# EAGLE schematic ALU (EAGLE 9.6.2)
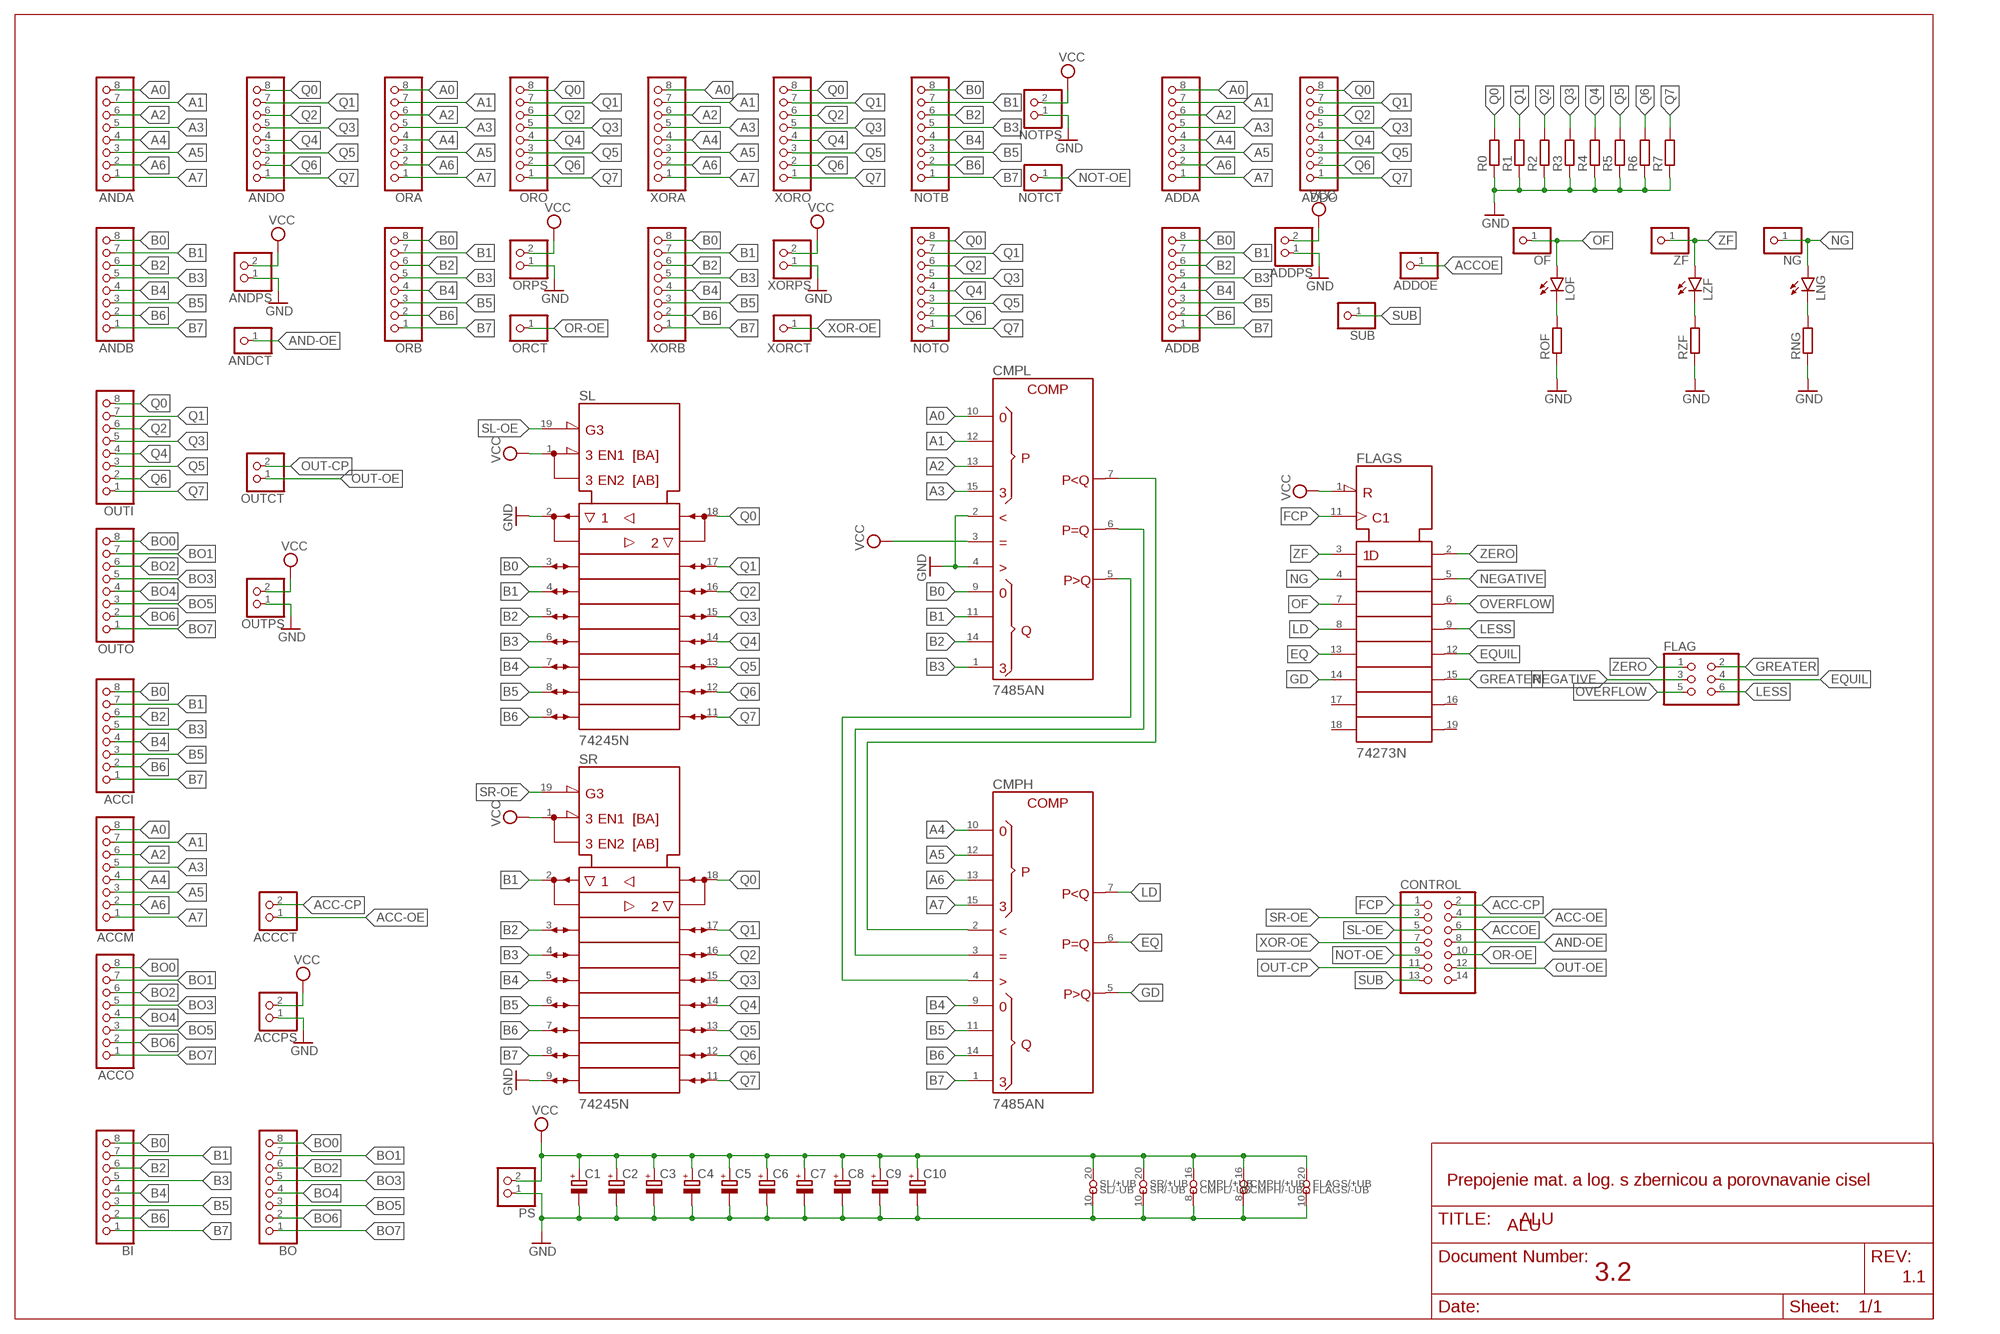
[diagram p0: schematic, sheet 1]

## Parts
ACCCT  PINHD-1X2  [1X02]
ACCI  PINHD-1X8  [1X08]
ACCM  PINHD-1X8  [1X08]
ACCO  PINHD-1X8  [1X08]
ACCPS  PINHD-1X2  [1X02]
ADDA  PINHD-1X8  [1X08]
ADDB  PINHD-1X8  [1X08]
ADDO  PINHD-1X8  [1X08]
ADDOE  PINHD-1X1  [1X01]
ADDPS  PINHD-1X2  [1X02]
ANDA  PINHD-1X8  [1X08]
ANDB  PINHD-1X8  [1X08]
ANDCT  PINHD-1X1  [1X01]
ANDO  PINHD-1X8  [1X08]
ANDPS  PINHD-1X2  [1X02]
BI  PINHD-1X8  [1X08]
BO  PINHD-1X8  [1X08]
C1  CPOL-EUE2.5-6  [E2,5-6]
C2  CPOL-EUE2.5-6  [E2,5-6]
C3  CPOL-EUE2.5-6  [E2,5-6]
C4  CPOL-EUE2.5-6  [E2,5-6]
C5  CPOL-EUE2.5-6  [E2,5-6]
C6  CPOL-EUE2.5-6  [E2,5-6]
C7  CPOL-EUE2.5-6  [E2,5-6]
C8  CPOL-EUE2.5-6  [E2,5-6]
C9  CPOL-EUE2.5-6  [E2,5-6]
C10  CPOL-EUE2.5-6  [E2,5-6]
CMPH  7485AN  [DIL16]
CMPL  7485AN  [DIL16]
CONTROL  PINHD-2X7  [2X07]
FLAG  PINHD-2X3  [2X03]
FLAGS  74273N  [DIL20]
LNG  LED5MM  [LED5MM]
LOF  LED5MM  [LED5MM]
LZF  LED5MM  [LED5MM]
NG  PINHD-1X1  [1X01]
NOTB  PINHD-1X8  [1X08]
NOTCT  PINHD-1X1  [1X01]
NOTO  PINHD-1X8  [1X08]
NOTPS  PINHD-1X2  [1X02]
OF  PINHD-1X1  [1X01]
ORA  PINHD-1X8  [1X08]
ORB  PINHD-1X8  [1X08]
ORCT  PINHD-1X1  [1X01]
ORO  PINHD-1X8  [1X08]
ORPS  PINHD-1X2  [1X02]
OUTCT  PINHD-1X2  [1X02]
OUTI  PINHD-1X8  [1X08]
OUTO  PINHD-1X8  [1X08]
OUTPS  PINHD-1X2  [1X02]
PS  PINHD-1X2  [1X02]
R0  R-EU_0204/7  [0204/7]
R1  R-EU_0204/7  [0204/7]
R2  R-EU_0204/7  [0204/7]
R3  R-EU_0204/7  [0204/7]
R4  R-EU_0204/7  [0204/7]
R5  R-EU_0204/7  [0204/7]
R6  R-EU_0204/7  [0204/7]
R7  R-EU_0204/7  [0204/7]
RNG  R-EU_0204/7  [0204/7]
ROF  R-EU_0204/7  [0204/7]
RZF  R-EU_0204/7  [0204/7]
SL  74245N  [DIL20]
SR  74245N  [DIL20]
SUB  PINHD-1X1  [1X01]
XORA  PINHD-1X8  [1X08]
XORB  PINHD-1X8  [1X08]
XORCT  PINHD-1X1  [1X01]
XORO  PINHD-1X8  [1X08]
XORPS  PINHD-1X2  [1X02]
ZF  PINHD-1X1  [1X01]

## Nets
A0: ACCM.8 ADDA.8 ANDA.8 CMPL.10(P0) ORA.8 XORA.8
A1: ACCM.7 ADDA.7 ANDA.7 CMPL.12(P1) ORA.7 XORA.7
A2: ACCM.6 ADDA.6 ANDA.6 CMPL.13(P2) ORA.6 XORA.6
A3: ACCM.5 ADDA.5 ANDA.5 CMPL.15(P3) ORA.5 XORA.5
A4: ACCM.4 ADDA.4 ANDA.4 CMPH.10(P0) ORA.4 XORA.4
A5: ACCM.3 ADDA.3 ANDA.3 CMPH.12(P1) ORA.3 XORA.3
A6: ACCM.2 ADDA.2 ANDA.2 CMPH.13(P2) ORA.2 XORA.2
A7: ACCM.1 ADDA.1 ANDA.1 CMPH.15(P3) ORA.1 XORA.1
ACC-CP: ACCCT.2 CONTROL.2
ACC-OE: ACCCT.1 CONTROL.4
ACCOE: ADDOE.1 CONTROL.6
AND-OE: ANDCT.1 CONTROL.8
B0: ACCI.8 ADDB.8 ANDB.8 BI.8 CMPL.9(Q0) NOTB.8 ORB.8 SL.3(A2) XORB.8
B1: ACCI.7 ADDB.7 ANDB.7 BI.7 CMPL.11(Q1) NOTB.7 ORB.7 SL.4(A3) SR.2(A1) XORB.7
B2: ACCI.6 ADDB.6 ANDB.6 BI.6 CMPL.14(Q2) NOTB.6 ORB.6 SL.5(A4) SR.3(A2) XORB.6
B3: ACCI.5 ADDB.5 ANDB.5 BI.5 CMPL.1(Q3) NOTB.5 ORB.5 SL.6(A5) SR.4(A3) XORB.5
B4: ACCI.4 ADDB.4 ANDB.4 BI.4 CMPH.9(Q0) NOTB.4 ORB.4 SL.7(A6) SR.5(A4) XORB.4
B5: ACCI.3 ADDB.3 ANDB.3 BI.3 CMPH.11(Q1) NOTB.3 ORB.3 SL.8(A7) SR.6(A5) XORB.3
B6: ACCI.2 ADDB.2 ANDB.2 BI.2 CMPH.14(Q2) NOTB.2 ORB.2 SL.9(A8) SR.7(A6) XORB.2
B7: ACCI.1 ADDB.1 ANDB.1 BI.1 CMPH.1(Q3) NOTB.1 ORB.1 SR.8(A7) XORB.1
BO0: ACCO.8 BO.8 OUTO.8
BO1: ACCO.7 BO.7 OUTO.7
BO2: ACCO.6 BO.6 OUTO.6
BO3: ACCO.5 BO.5 OUTO.5
BO4: ACCO.4 BO.4 OUTO.4
BO5: ACCO.3 BO.3 OUTO.3
BO6: ACCO.2 BO.2 OUTO.2
BO7: ACCO.1 BO.1 OUTO.1
EQ: CMPH.6(PEQQ) FLAGS.13(5D)
EQUIL: FLAG.4 FLAGS.12(5Q)
FCP: CONTROL.1 FLAGS.11(CLK)
GD: CMPH.5(PGTQ) FLAGS.14(6D)
GND: ACCPS.1 ADDPS.1 ANDPS.1 C1.- C2.- C3.- C4.- C5.- C6.- C7.- C8.- C9.- C10.- CMPH.8(-UB) CMPL.2(PLTQ_) CMPL.4(PGTQ_) CMPL.8(-UB) FLAGS.10(-UB) NOTPS.1 ORPS.1 OUTPS.1 PS.1 R0.1 R1.1 R2.1 R3.1 R4.1 R5.1 R6.1 R7.1 RNG.1 ROF.1 RZF.1 SL.2(A1) SL.10(-UB) SR.9(A8) SR.10(-UB) XORPS.1
GREATER: FLAG.2 FLAGS.15(6Q)
LD: CMPH.7(PLTQ) FLAGS.8(4D)
LESS: FLAG.6 FLAGS.9(4Q)
N$1: LOF.K(C) ROF.2
N$2: LZF.K(C) RZF.2
N$3: LNG.K(C) RNG.2
N$26: CMPH.4(PGTQ_) CMPL.5(PGTQ)
N$27: CMPH.3(PEQQ_) CMPL.6(PEQQ)
N$28: CMPH.2(PLTQ_) CMPL.7(PLTQ)
NEGATIVE: FLAG.3 FLAGS.5(2Q)
NG: FLAGS.4(2D) LNG.A NG.1
NOT-OE: CONTROL.9 NOTCT.1
OF: FLAGS.7(3D) LOF.A OF.1
OR-OE: CONTROL.10 ORCT.1
OUT-CP: CONTROL.11 OUTCT.2
OUT-OE: CONTROL.12 OUTCT.1
OVERFLOW: FLAG.5 FLAGS.6(3Q)
Q0: ADDO.8 ANDO.8 NOTO.8 ORO.8 OUTI.8 R0.2 SL.18(B1) SR.18(B1) XORO.8
Q1: ADDO.7 ANDO.7 NOTO.7 ORO.7 OUTI.7 R1.2 SL.17(B2) SR.17(B2) XORO.7
Q2: ADDO.6 ANDO.6 NOTO.6 ORO.6 OUTI.6 R2.2 SL.16(B3) SR.16(B3) XORO.6
Q3: ADDO.5 ANDO.5 NOTO.5 ORO.5 OUTI.5 R3.2 SL.15(B4) SR.15(B4) XORO.5
Q4: ADDO.4 ANDO.4 NOTO.4 ORO.4 OUTI.4 R4.2 SL.14(B5) SR.14(B5) XORO.4
Q5: ADDO.3 ANDO.3 NOTO.3 ORO.3 OUTI.3 R5.2 SL.13(B6) SR.13(B6) XORO.3
Q6: ADDO.2 ANDO.2 NOTO.2 ORO.2 OUTI.2 R6.2 SL.12(B7) SR.12(B7) XORO.2
Q7: ADDO.1 ANDO.1 NOTO.1 ORO.1 OUTI.1 R7.2 SL.11(B8) SR.11(B8) XORO.1
SL-OE: CONTROL.5 SL.19(!G)
SR-OE: CONTROL.3 SR.19(!G)
SUB: CONTROL.13 SUB.1
VCC: ACCPS.2 ADDPS.2 ANDPS.2 C1.+ C2.+ C3.+ C4.+ C5.+ C6.+ C7.+ C8.+ C9.+ C10.+ CMPH.16(+UB) CMPL.3(PEQQ_) CMPL.16(+UB) FLAGS.1(!CLR) FLAGS.20(+UB) NOTPS.2 ORPS.2 OUTPS.2 PS.2 SL.1(DIR) SL.20(+UB) SR.1(DIR) SR.20(+UB) XORPS.2
XOR-OE: CONTROL.7 XORCT.1
ZERO: FLAG.1 FLAGS.2(1Q)
ZF: FLAGS.3(1D) LZF.A ZF.1
Unconnected: CONTROL.14 FLAGS.16(7Q) FLAGS.17(7D) FLAGS.18(8D) FLAGS.19(8Q)

## Notes on the sheet
- Prepojenie mat. a log. s zbernicou a porovnavanie cisel
- ALU
- 3.2 | 1.1

## Library data of the parts
ACCCT ACCPS ADDPS ANDPS NOTPS ORPS OUTCT OUTPS PS XORPS = pinhead:PINHD-1X2: PIN HEADER
ACCI ACCM ACCO ADDA ADDB ADDO ANDA ANDB ANDO BI BO NOTB NOTO ORA ORB ORO OUTI OUTO XORA XORB XORO = pinhead:PINHD-1X8: PIN HEADER
ADDOE ANDCT NG NOTCT OF ORCT SUB XORCT ZF = pinhead:PINHD-1X1: PIN HEADER
C1-C10 = rcl:CPOL-EU: POLARIZED CAPACITOR, European symbol; SPICEPREFIX: C
CMPH CMPL = 74ttl-din:74*85A: 4-bit Magnitude COMPARATOR
CONTROL = pinhead:PINHD-2X7: PIN HEADER
FLAG = pinhead:PINHD-2X3: PIN HEADER
FLAGS = 74ttl-din:74*273: Octal D type FLIP FLOP, clear
LNG LOF LZF = led:LED: LED OSRAM: - CHIPLED LG R971, LG N971, LY N971, LG Q971, LY Q971, LO R971, LY R971 LH N974, LH R974 LS Q976, LO Q976, LY Q976 LO Q996 - Hyper CHIPLED LW Q18S LB Q993, LB Q99A, LB R99A - SideLED LS A670, LO A670, LY A670, LG A670, LP A670 LB A673, LV A673, LT A673, LW A673 LH A674 LY A675 LS A676, LA A676, LO A676, LY A676, LW A676 LS A679, LY A679, LG A679 - Hyper Micro SIDELED® LS Y876, LA Y876, LO Y876, LY Y876 LT Y87S - SmartLED LW L88C, LW L88S LB L89C, LB L89S, LG L890 LS L89K, LO L89K, LY L89K LS L896, LA L896, LO L896, LY L896 - TOPLED LS T670, LO T670, LY T670, LG T670, LP T670 LSG T670, LSP T670, LSY T670, LOP T670, LYG T670 LG T671, LOG T671, LSG T671 LB T673, LV T673, LT T673, LW T673 LH T674 LS T676, LA T676, LO T676, LY T676, LB T676, LH T676, LSB T676, LW T676 LB T67C, LV T67C, LT T67C, LS T67K, LO T67K, LY T67K, LW E67C LS E67B, LA E67B, LO E67B, LY E67B, LB E67C, LV E67C, LT E67C LW T67C LS T679, LY T679, LG T679 LS T770, LO T770, LY T770, LG T770, LP T770 LB T773, LV T773, LT T773, LW T773 LH T774 LS E675, LA E675, LY E675, LS T675 LS T776, LA T776, LO T776, LY T776, LB T776 LHGB T686 LT T68C, LB T68C - Hyper Mini TOPLED® LB M676 - Mini TOPLED Santana® LG M470 LS M47K, LO M47K, LY M47K Source: http://www.osram.convergy.de LUXEON: - LUMILED® LXK2-PW12-R00, LXK2-PW12-S00, LXK2-PW14-U00, LXK2-PW14-V00 LXK2-PM12-R00, LXK2-PM12-S00, LXK2-PM14-U00 LXK2-PE12-Q00, LXK2-PE12-R00, LXK2-PE12-S00, LXK2-PE14-T00, LXK2-PE14-U00 LXK2-PB12-K00, LXK2-PB12-L00, LXK2-PB12-M00, LXK2-PB14-N00, LXK2-PB14-P00, LXK2-PB14-Q00 LXK2-PR12-L00, LXK2-PR12-M00, LXK2-PR14-Q00, LXK2-PR14-R00 LXK2-PD12-Q00, LXK2-PD12-R00, LXK2-PD12-S00 LXK2-PH12-R00, LXK2-PH12-S00 LXK2-PL12-P00, LXK2-PL12-Q00, LXK2-PL12-R00 Source: www.luxeon.com KINGBRIGHT: KA-3528ASYC Source: www.kingbright.com
R0 R1-R7 RNG ROF RZF = rcl:R-EU_: RESISTOR, European symbol; SPICEPREFIX: R
SL SR = 74ttl-din:74*245: Octal BUS TRANSCEIVER, 3-state